# Altium schematic sheet Net.SchDoc: Net
size A4
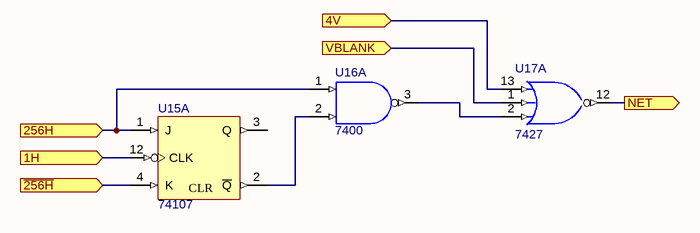
[diagram p0: Net.SchDoc]

## Parts
U15  74107  [N014]  (part A of 2)
U16  7400  [N014]  (part A of 4)
U17  7427  [N014]  (part A of 3)

## Ports
1H, 4V, 256H, NET, VBLANK, ~{256H}

## Nets
GND: U15.7(GND) U16.7(GND) U17.7(GND)
VCC: U15.13(CLR) U15.14(VCC) U16.14(VCC) U17.14(VCC)
1H: U15.12(CLK) ; port 1H
4V: U17.13(C) ; port 4V
256H: U15.1(J) U16.1(A) ; port 256H
~{256H}: U15.4(K) ; port ~{256H}
NET: U17.12(Y) ; port NET
VBLANK: U17.1(A) ; port VBLANK
NetU15_2: U15.2(~{Q}) U16.2(B)
NetU16_3: U16.3(Y) U17.2(B)

Not connected (* = marked no-connect by the designer): U15 3(Q)

## Notes on the sheet
- Text
- Page
- PONG

## Library data of the parts
U15 = SN74LS107AN: Dual J-K Flip-Flop with Clear; Published: 8-Jun-2000; LatestRevisionDate: 04-Mar-2005; LatestRevisionNote: Stylized 3D Model Added.; DatasheetVersion: Mar-1988; PackageVersion: Oct-1995; PackageReference: N014; Publisher: Altium Limited; PackageDescription: DIP; 14 Leads; Row Spacing 7.62 mm; Pitch 2.54 mm; ComponentLink1Description: Manufacturer Link; ComponentLink1URL: http://www.ti.com/; ComponentLink2Description: Datasheet; ComponentLink2URL: http://www-s.ti.com/sc/ds/sn74ls107a.pdf
U16 = SN74LS00N: Quadruple 2-Input Positive-NAND Gate; Published: 8-Jun-2000; LatestRevisionDate: 04-Mar-2005; LatestRevisionNote: Stylized 3D Model Added.; DatasheetVersion: Mar-1988; PackageVersion: Oct-1995; PackageReference: N014; Publisher: Altium Limited; PackageDescription: DIP; 14 Leads; Row Spacing 7.62 mm; Pitch 2.54 mm; ComponentLink1Description: Manufacturer Link; ComponentLink1URL: http://www.ti.com/; ComponentLink2Description: Datasheet; ComponentLink2URL: http://www-s.ti.com/sc/ds/sn74ls00.pdf
U17 = SN74LS27N: Triple 3-Input Positive-NOR Gate; Published: 8-Jun-2000; LatestRevisionDate: 04-Mar-2005; LatestRevisionNote: Stylized 3D Model Added.; DatasheetVersion: Mar-1988; PackageVersion: Oct-1995; PackageReference: N014; Publisher: Altium Limited; PackageDescription: DIP; 14 Leads; Row Spacing 7.62 mm; Pitch 2.54 mm; ComponentLink1Description: Manufacturer Link; ComponentLink1URL: http://www.ti.com/; ComponentLink2Description: Datasheet; ComponentLink2URL: http://www-s.ti.com/sc/ds/sn74ls27.pdf